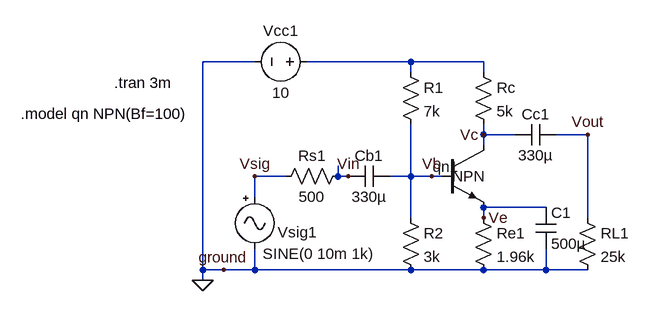
[diagram p0: schematic Draft2.asc]
Draft2.asc, the LTspice schematic file:
Version 4
SHEET 1 880 680
WIRE -16 80 -96 80
WIRE 224 80 64 80
WIRE 336 80 224 80
WIRE 224 96 224 80
WIRE 336 96 336 80
WIRE 336 192 336 176
WIRE 384 192 336 192
WIRE 496 192 448 192
WIRE 336 208 336 192
WIRE 32 256 -16 256
WIRE 112 256 112 240
WIRE 128 256 112 256
WIRE 224 256 224 176
WIRE 224 256 192 256
WIRE 256 256 224 256
WIRE 272 256 256 256
WIRE -16 288 -16 256
WIRE 432 304 336 304
WIRE 224 320 224 256
WIRE 336 320 336 304
WIRE 496 320 496 192
WIRE -96 400 -96 80
WIRE -64 400 -96 400
WIRE -16 400 -16 368
WIRE -16 400 -64 400
WIRE 224 400 -16 400
WIRE 336 400 224 400
WIRE 432 400 432 368
WIRE 432 400 336 400
WIRE 496 400 432 400
WIRE -96 416 -96 400
FLAG -64 400 ground
FLAG -96 416 0
FLAG 336 320 Ve
FLAG 256 256 Vb
FLAG 496 192 Vout
FLAG 128 256 Vin
FLAG -16 256 Vsig
FLAG 336 192 Vc
SYMBOL voltage 80 80 R90
WINDOW 0 -32 56 VBottom 2
WINDOW 3 32 56 VTop 2
SYMATTR InstName Vcc1
SYMATTR Value 10
SYMBOL res 320 80 R0
SYMATTR InstName Rc
SYMATTR Value 5k
SYMBOL res 208 80 R0
SYMATTR InstName R1
SYMATTR Value 7k
SYMBOL cap 448 176 R90
WINDOW 0 0 32 VBottom 2
WINDOW 3 32 32 VTop 2
SYMATTR InstName Cc1
SYMATTR Value 330µ
SYMBOL cap 192 240 R90
WINDOW 0 0 32 VBottom 2
WINDOW 3 32 32 VTop 2
SYMATTR InstName Cb1
SYMATTR Value 330µ
SYMBOL res 16 272 R270
WINDOW 0 32 56 VTop 2
WINDOW 3 0 56 VBottom 2
SYMATTR InstName Rs1
SYMATTR Value 500
SYMBOL res 208 304 R0
SYMATTR InstName R2
SYMATTR Value 3k
SYMBOL res 320 304 R0
SYMATTR InstName Re1
SYMATTR Value 1.96k
SYMBOL res 480 304 R0
SYMATTR InstName RL1
SYMATTR Value 25k
SYMBOL npn 272 208 R0
WINDOW 0 -14 33 Left 2
WINDOW 3 16 48 Left 2
SYMATTR InstName qn1
SYMBOL signal -16 272 R0
WINDOW 0 35 70 Left 2
WINDOW 3 12 103 Left 2
WINDOW 123 0 0 Left 2
WINDOW 39 0 0 Left 2
SYMATTR InstName Vsig1
SYMATTR Value SINE(0 10m 1k)
SYMBOL cap 416 304 R0
SYMATTR InstName C1
SYMATTR Value 500µ
TEXT -376 160 Left 2 !.model qn NPN(Bf=100)
TEXT -232 112 Left 2 !.tran 3m

The netlist it stands for:
* Draft2.asc
Vcc1 N001 0 10
Rc N001 Vc 5k
R1 N001 Vb 7k
Cc1 Vout Vc 330µ
Cb1 Vb Vin 330µ
Rs1 Vsig Vin 500
R2 Vb 0 3k
Re1 Ve 0 1.96k
RL1 Vout 0 25k
qn1 Vc Vb Ve 0 NPN
Vsig1 Vsig 0 SINE(0 10m 1k)
C1 Ve 0 500µ
.model NPN NPN
.model PNP PNP
.lib standard.bjt
.model qn NPN(Bf=100)
.tran 3m
.backanno
.end